# EAGLE design spectrometer-breakout-1c2 (EAGLE 9.6.2)
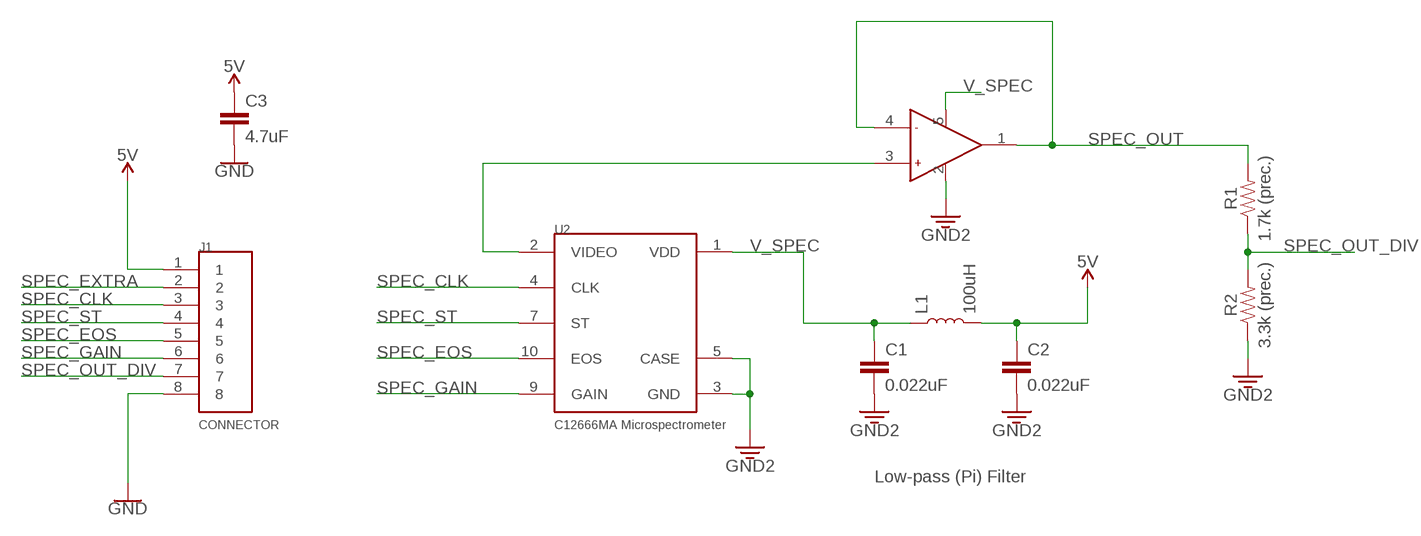
[diagram p0: schematic, sheet 1]

## Parts
C1  0.022uF  CAP-0603  [0603]
C2  0.022uF  CAP-0603  [0603]
C3  4.7uF  CAP-0603  [0603]
J1  CON-SM08B-SRSS-TB  [CON-SM08B-SRSS-TB]
L1  100uH  INDUCTORDNP  [0603]
R1  1.7k (prec.)  RESISTOR0603  [0603]
R2  3.3k (prec.)  RESISTOR0603  [0603]
U1  OPA344NA/250  [SOT3-5]
U2  C12666MA  [C12666MA]

## Nets
5V: C2.1 C3.1 J1.1 L1.2
GND: C1.2 C2.2 C3.2 J1.8 R2.1 U1.2(GND) U2.3(GND) U2.5(CASE) ; supply symbol labelled GND2
N$1: U1.3(+) U2.2(VIDEO)
SPEC_CLK: J1.3 U2.4(CLK)
SPEC_EOS: J1.5 U2.10(EOS)
SPEC_EXTRA: J1.2
SPEC_GAIN: J1.6 U2.9(GAIN)
SPEC_OUT: R1.2 U1.1(OUT) U1.4(-)
SPEC_OUT_DIV: J1.7 R1.1 R2.2
SPEC_ST: J1.4 U2.7(ST)
V_SPEC: C1.1 L1.1 U1.5(VCC) U2.1(VDD)

## Notes on the sheet
- Low-pass (Pi) Filter

## Library data of the parts
C1-C3 = SparkFun-Capacitors:CAP
J1 = notes1a:CON-SM08B-SRSS-TB
L1 = SparkFun-Coils:INDUCTOR: Inductors Resist changes in electrical current. Basically a coil of wire. SparkFun Products: SparkFun Load Cell Amplifier - HX711 <https://www.sparkfun.com/products/13879> IOIO-OTG - V2.2 <https://www.sparkfun.com/products/13613>
R1 R2 = SparkFun-Resistors:RESISTOR: Generic Resistor Package
U1 = notes1a:OPA344NA/250: OPA344 OpAmp
U2 = notes1a:C12666MA: Hamamatsu 12666MA Microspectrometer

## Board
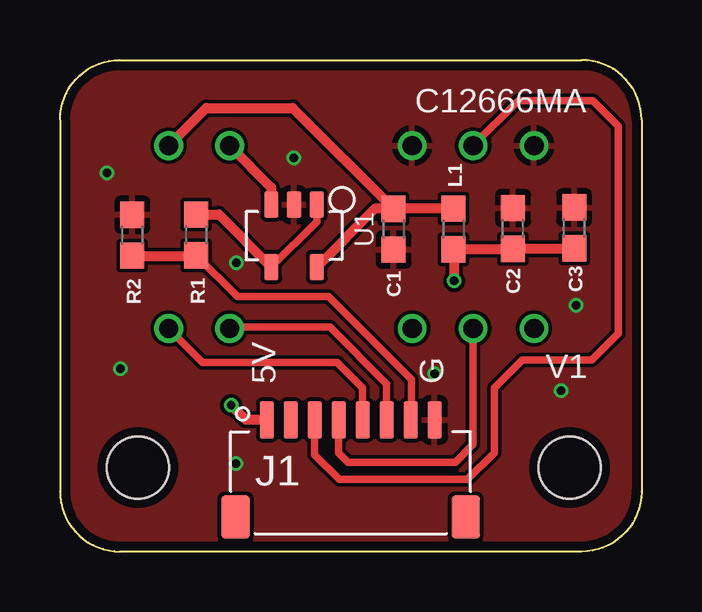
[diagram p1: board, top side]
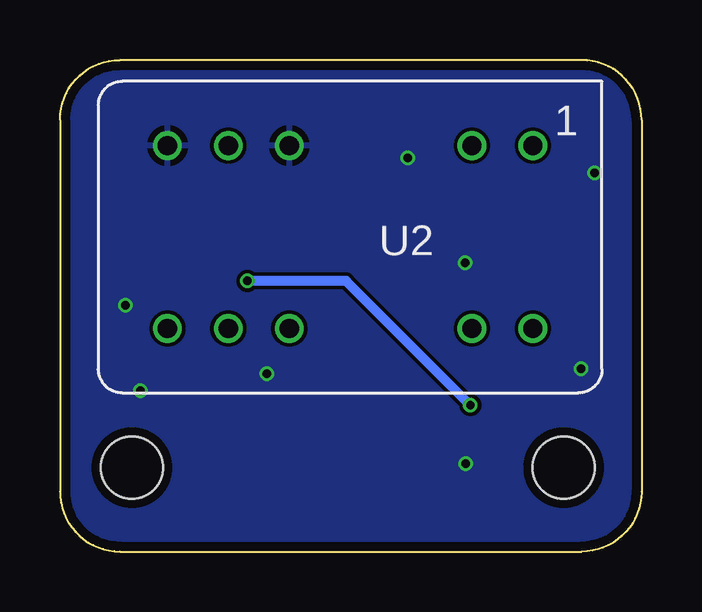
[diagram p2: board, bottom side, seen from below]

Size 24.25 x 20.5 mm. Coordinates in mm from the lower left corner, seen from the top.
Outline: 0,18 arc-90 2.5,20.5 21.75,20.5 arc-90 24.25,18 24.25,2.5 arc-90 21.75,0 2.5,0 arc-90 0,2.5 0,18
Copper layers (1*16): Top 0.035559375mm / dielectric 1.6mm / Bottom 0.035559375mm
Design rules "oshpark-2layer *": minimum track width 6mil, minimum drill 10mil, track to track 6mil, track to pad 6mil, pad to pad 6mil, via to via 6mil, smd to smd 6mil, copper to edge 15mil, drill to drill 6mil, minimum pad ring 5mil, minimum via ring 5mil, stop-mask expansion 2.5mil, vias tented up to drill 14mil, thermal gap 10mil
Holes 2.6 mm at 3.25,3.5 21.25,3.5

### Footprints (pad centres in the part's own frame; a part is rotated, then mirrored left to right if it is on the bottom)
0603 = smd 1.1 x 1: 1 -0.85,0; 2 0.85,0
CON-SM08B-SRSS-TB = smd 0.6 x 1.55: 1 -3.5,2.21; 2 -2.5,2.21; 3 -1.5,2.21; 4 -0.5,2.21; 5 0.5,2.21; 6 1.5,2.21; 7 2.5,2.21; 8 3.5,2.21 | smd 1.2 x 1.8: PAD1 -4.8,-1.84; PAD2 4.8,-1.84
SOT3-5 = smd 1.1 x 0.6: 1 -1.3,0.95; 2 -1.3,0; 3 -1.3,-0.95; 4 1.3,-0.95; 5 1.3,0.95
C12666MA = drill 0.8: 1 -7.62,-3.81; 2 -5.08,-3.81; 3 2.54,-3.81; 4 5.08,-3.81; 5 7.62,-3.81; 6 7.62,3.81; 7 5.08,3.81; 8 2.54,3.81; 9 -5.08,3.81; 10 -7.62,3.81

### Placement (x,y rotation side)
C1  13.91,13.44 270 top
C2  18.89,13.47 90 top
C3  21.44,13.5 90 top
J1  12.12,3.28 0 top
L1  16.41,13.45 270 top
R1  5.69,13.2 90 top
R2  3.02,13.19 270 top
U1  9.76,13.17 270 top
U2  12.15,13.11 180 bottom

### Tracks (layer width: path | path; a pad name or v marks a point on that pad's centre or on a via)
5V  (via drill 0.35)
  Top 0.203: L1.2 16.43,12.58
  Top 0.406: C3.1 21.41,12.62 C2.1 18.87,12.6 L1.2 | J1.1 7.75,5.49 v7.14,6.1 | 16.43,12.58 v16.43,11.29
  Bottom 0.406: v7.14,6.1 12.32,11.29 v16.43,11.29
GND  (via drill 0.35)
  other vias: 9.75,16.41 7.35,12.04 1.96,15.79 7.34,3.67 15.62,7.42 20.9,6.71 21.51,10.27 2.51,7.63
  pour Top: 0,20.5 0,0 24.25,0 24.25,20.5
  pour Bottom: 0,20.5 0,0 24.25,0 24.25,20.5
N$1
  Top 0.406: U2.2 8.81,15.18 U1.3
SPEC_CLK
  Top 0.305: J1.3 10.62,4.04 11.66,3 16.99,3 18.11,4.12 18.11,6.82 19.28,7.98 22.17,7.98 23.29,9.1 23.29,17.74 22.23,18.8 19.11,18.8 U2.4
SPEC_EOS
  Top 0.305: J1.5 12.62,6.82 11.56,7.88 5.95,7.88 U2.10
SPEC_GAIN
  Top 0.305: J1.6 13.62,6.98 11.25,9.36 7.12,9.36 U2.9
SPEC_OUT
  Top 0.305: U1.1 10.71,13.77 U1.4
  Top 0.406: R1.2 6.63,14.05 U1.4
SPEC_OUT_DIV
  Top 0.203: R2.2 3.06,12.3 3.23,12.3
  Top 0.305: R1.1 7.41,10.62 11.2,10.62 14.66,7.17 14.66,5.52 J1.7
  Top 0.406: R1.1 5.63,12.3 3.23,12.3 3.02,12.3
SPEC_ST
  Top 0.305: J1.4 11.62,4.11 12.01,3.72 16.48,3.72 17.23,4.46 U2.7
V_SPEC
  Top 0.406: L1.1 13.92,14.3 C1.1 | C1.1 13.13,14.29 U1.5 | U2.1 6.1,18.5 9.7,18.5 C1.1

### Text on the board
tPlace: C12666MA | 5V | G | V1